# Altium schematic sheet 1_P1.schdoc
size 309 x 223 mm; Symbol: Sheet-Symbol_A4; Device: Sheet-Symbol_A4; Company: 嘉立创EDA; Version: V1.0; Page Size: A4; @Project Name: Smart_security; @Page Count: 1; @Update Date: 2024-12-20; @Create Date: 2024-12-19; @Schematic Name: Schematic1; @Page No: 1; @Page Name: P1; @Board Name: Board1; @Create Time: 13:26:19; @Update Time: 15:30:08
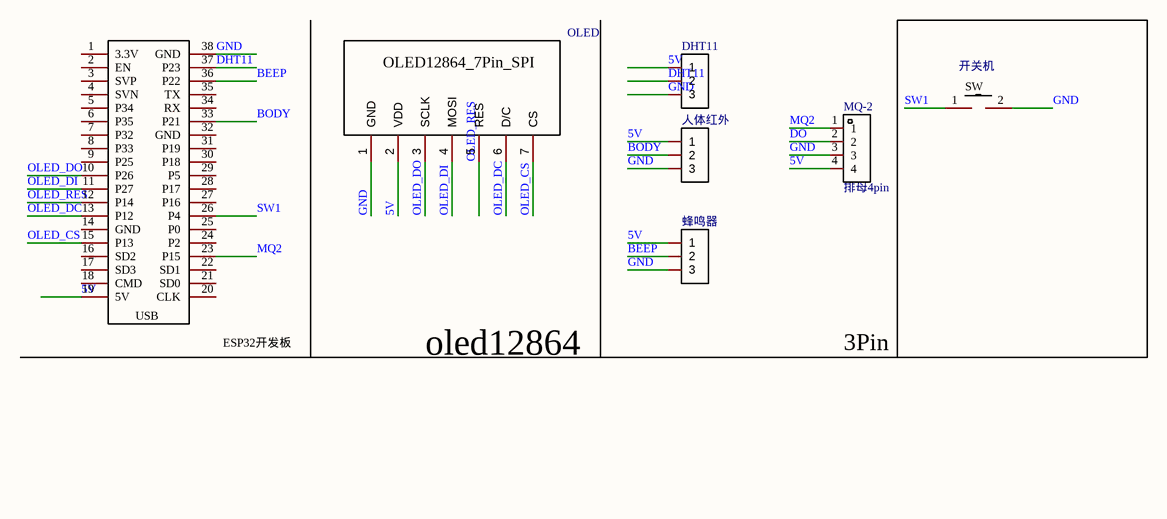
[diagram p0: 1_P1.schdoc]

## Parts
DHT11  DHT11  [HDR-F-2.54_1X3]  (value not drawn)
ESP32_38PIN_1  ESP32_38PIN  [ESP32_38PIN教学]  (value not drawn)
MQ-2  排母4pin  [排母4PIN]  (value not drawn)
OLED  OLED12864_7Pin_SPI  [OLED-12864(7PIN-SPI)]  (value not drawn)
人体红外  人体红外  [HDR-F-2.54_1X3]  (value not drawn)
开关机  按键  [pb]  (value not drawn)
蜂鸣器  蜂鸣器  [HDR-F-2.54_1X3]  (value not drawn)

## Nets
5V: DHT11.1 ESP32_38PIN_1.19(5V) MQ-2.4 OLED.2(VDD) 人体红外.1 蜂鸣器.1
BEEP: ESP32_38PIN_1.36(P22) 蜂鸣器.2
BODY: ESP32_38PIN_1.33(P21) 人体红外.2
DHT11: DHT11.2 ESP32_38PIN_1.37(P23)
DO: MQ-2.2
GND: DHT11.3 ESP32_38PIN_1.38(GND) MQ-2.3 OLED.1(GND) 人体红外.3 开关机.2 蜂鸣器.3
MQ2: ESP32_38PIN_1.23(P15) MQ-2.1
OLED_CS: ESP32_38PIN_1.15(P13) OLED.7(CS)
OLED_DC: ESP32_38PIN_1.13(P12) OLED.6(D/C)
OLED_DI: ESP32_38PIN_1.11(P27) OLED.4(MOSI)
OLED_DO: ESP32_38PIN_1.10(P26) OLED.3(SCLK)
OLED_RES: ESP32_38PIN_1.12(P14) OLED.5(RES)
SW1: ESP32_38PIN_1.26(P4) 开关机.1

Not connected (* = marked no-connect by the designer): ESP32_38PIN_1 1(3.3V) 2(EN) 3(SVP) 4(SVN) 5(P34) 6(P35) 7(P32) 8(P33) 9(P25) 14(GND) 16(SD2) 17(SD3) 18(CMD) 20(CLK) 21(SD0) 22(SD1) 24(P2) 25(P0) 27(P16) 28(P17) 29(P5) 30(P18) 31(P19) 32(GND) 34(RX) 35(TX)

## Notes on the sheet
- (near ESP32_38PIN_1) ESP32开发板
- oled12864
- 3Pin
- 1
- 2
- 3
- 4
- 5
- 6
- A
- B
- C
- 原理图
- Schematic1
- 创建日期
- 更新日期
- 2024-12-20
- 2024-12-19
- 审阅
- 绘制
- 图页
- P1
- 物料编码
- Smart_security
- D
- 版本
- 尺寸
- 页
- 共
- V1.0
- A4
- 嘉立创EDA
- (in symbol ESP32_38PIN) USB
- (in symbol 按键) SW

## Library data of the parts
DHT11 人体红外 蜂鸣器 = 排母3PIN: Add into BOM: yes; Symbol: 排母3PIN; Device: 排母3PIN; Convert to PCB: yes; 3DModel: HDR-F-2.54_1x3; link: https://www.cjt.com/Upload/A2541.pdf; Supplier Part: C146690; Supplier: LCSC
ESP32_38PIN_1 = ESP32_38PIN: Add into BOM: yes; Symbol: ESP32_38PIN; Device: ESP32_38PIN; Convert to PCB: yes
MQ-2 = 排母4pin: Add into BOM: yes; Symbol: 排母4pin; Device: 排母4pin; Convert to PCB: yes
OLED = OLED12864_7Pin_SPI: Add into BOM: yes; Symbol: OLED12864_7Pin_SPI; Device: OLED12864_7Pin_SPI; Convert to PCB: yes; Supplier Part: undefined
开关机 = 按键: Add into BOM: yes; Symbol: 按键; Device: 按键; Convert to PCB: yes